# Altium schematic sheet QCopterRC_FFCSPI_Sch.SchDoc
size A4
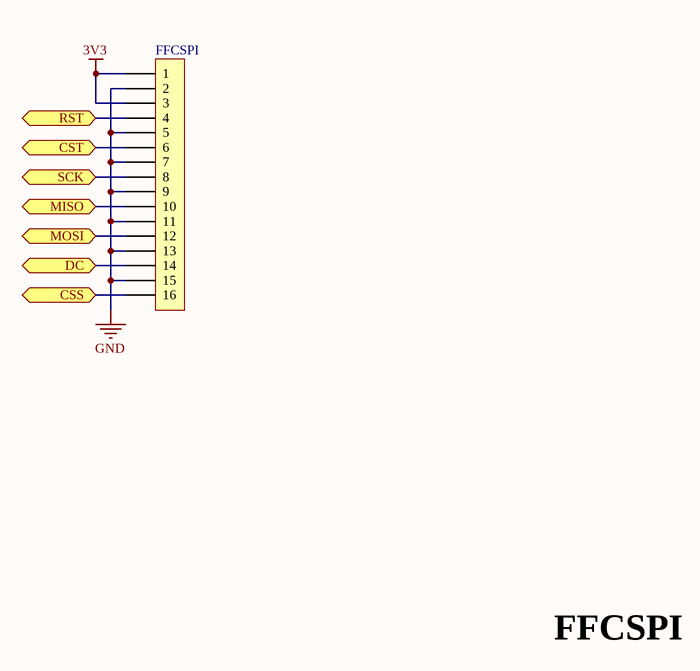
[diagram p0: QCopterRC_FFCSPI_Sch.SchDoc]

## Parts
FFCSPI  FFC_0.5_16  [FFC_0.5_16]  (value not drawn)

## Ports
CSS, CST, DC, MISO, MOSI, RST, SCK

## Nets
3V3: FFCSPI.1 FFCSPI.3
GND: FFCSPI.2 FFCSPI.5 FFCSPI.7 FFCSPI.9 FFCSPI.11 FFCSPI.13 FFCSPI.15
CSS: FFCSPI.16 ; port CSS
CST: FFCSPI.6 ; port CST
DC: FFCSPI.14 ; port DC
MISO: FFCSPI.10 ; port MISO
MOSI: FFCSPI.12 ; port MOSI
RST: FFCSPI.4 ; port RST
SCK: FFCSPI.8 ; port SCK

## Notes on the sheet
- FFCSPI

## Library data of the parts
FFCSPI = FFC_0.5_16: FFC